# EAGLE design bmowdisk (EAGLE 6.6.0)
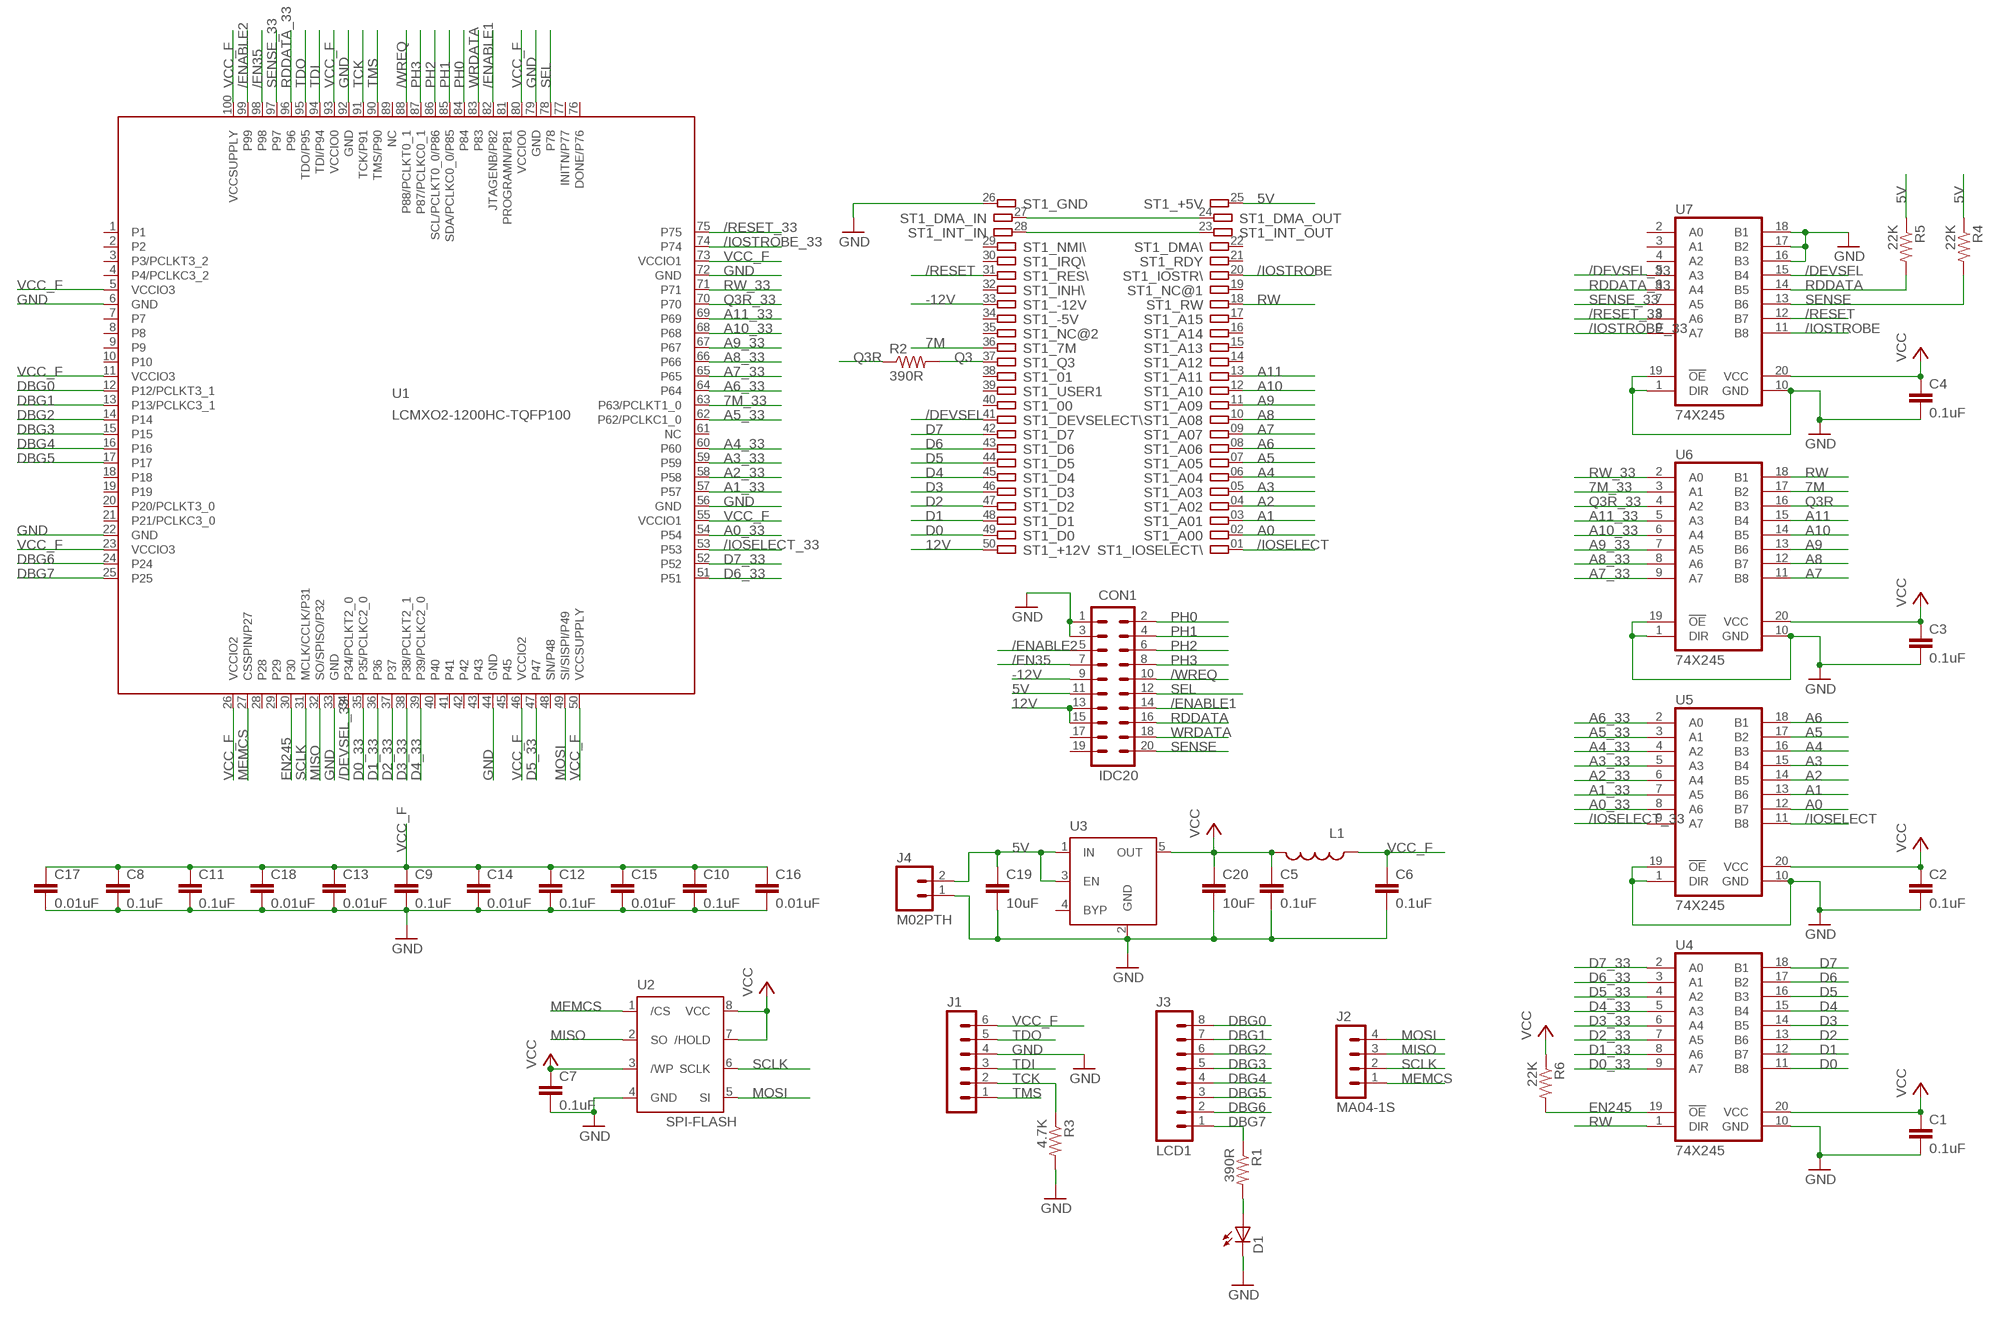
[diagram p0: schematic, sheet 1]

## Parts
C1  0.1uF  CAP0805  [0805]
C2  0.1uF  CAP0805  [0805]
C3  0.1uF  CAP0805  [0805]
C4  0.1uF  CAP0805  [0805]
C5  0.1uF  CAP0805  [0805]
C6  0.1uF  CAP0805  [0805]
C7  0.1uF  CAP0805  [0805]
C8  0.1uF  CAP0805  [0805]
C9  0.1uF  CAP0805  [0805]
C10  0.1uF  CAP0805  [0805]
C11  0.1uF  CAP0805  [0805]
C12  0.1uF  CAP0805  [0805]
C13  0.01uF  CAP0805  [0805]
C14  0.01uF  CAP0805  [0805]
C15  0.01uF  CAP0805  [0805]
C16  0.01uF  CAP0805  [0805]
C17  0.01uF  CAP0805  [0805]
C18  0.01uF  CAP0805  [0805]
C19  10uF  CAP0805  [0805]
C20  10uF  CAP0805  [0805]
CON1  IDC20  [IDC20]
D1  LEDCHIP-LED0805  [CHIP-LED0805]
J1  MA06-1NORMAL  [MA06-1]
J2  MA04-1S  [MA04-1]
J3  LCD1  M081X08  [1X08]
J4  M02PTH  [1X02]
L1  INDUCTOR0805  [0805]
R1  390R  RESISTOR0805-RES  [0805]
R2  390R  RESISTOR0805-RES  [0805]
R3  4.7K  RESISTOR0805-RES  [0805]
R4  22K  RESISTOR0805-RES  [0805]
R5  22K  RESISTOR0805-RES  [0805]
R6  22K  RESISTOR0805-RES  [0805]
ST1  A2-50PINMINI  [A2-50PIN-MINI]
U1  LCMXO2-1200HC-TQFP100  [TQFP100]
U2  SPI-FLASH  [SOIC08]
U3  MIC5219XX  [SOT23-5]
U4  74X245  [SSOP20]
U5  74X245  [SSOP20]
U6  74X245  [SSOP20]
U7  74X245  [SSOP20]

## Nets
5V: C19.1 CON1.11 J4.2 R4.1 R5.1 ST1.25 U3.1(IN) U3.3(EN)
7M: ST1.36 U6.17(B2)
7M_33: U1.63(P63/PCLKT1_0) U6.3(A1)
12V: CON1.13 CON1.15 ST1.50
-12V: CON1.9 ST1.33
/DEVSEL: ST1.41 U7.15(B4)
/DEVSEL_33: U1.34(P34/PCLKT2_0) U7.5(A3)
/EN35: CON1.7 U1.98
/ENABLE1: CON1.14 U1.82(JTAGENB/P82)
/ENABLE2: CON1.5 U1.99
/IOSELECT: ST1.01 U5.11(B8)
/IOSELECT_33: U1.53 U5.9(A7)
/IOSTROBE: ST1.20 U7.11(B8)
/IOSTROBE_33: U1.74 U7.9(A7)
/RESET: ST1.31 U7.12(B7)
/RESET_33: U1.75 U7.8(A6)
/WREQ: CON1.10 U1.88(P88/PCLKT0_1)
A0: ST1.02 U5.12(B7)
A0_33: U1.54 U5.8(A6)
A1: ST1.03 U5.13(B6)
A1_33: U1.57 U5.7(A5)
A2: ST1.04 U5.14(B5)
A2_33: U1.58 U5.6(A4)
A3: ST1.05 U5.15(B4)
A3_33: U1.59 U5.5(A3)
A4: ST1.06 U5.16(B3)
A4_33: U1.60 U5.4(A2)
A5: ST1.07 U5.17(B2)
A5_33: U1.62(P62/PCLKC1_0) U5.3(A1)
A6: ST1.08 U5.18(B1)
A6_33: U1.64 U5.2(A0)
A7: ST1.09 U6.11(B8)
A7_33: U1.65 U6.9(A7)
A8: ST1.10 U6.12(B7)
A8_33: U1.66 U6.8(A6)
A9: ST1.11 U6.13(B6)
A9_33: U1.67 U6.7(A5)
A10: ST1.12 U6.14(B5)
A10_33: U1.68 U6.6(A4)
A11: ST1.13 U6.15(B4)
A11_33: U1.69 U6.5(A3)
D0: ST1.49 U4.11(B8)
D0_33: U1.35(P35/PCLKC2_0) U4.9(A7)
D1: ST1.48 U4.12(B7)
D1_33: U1.36 U4.8(A6)
D2: ST1.47 U4.13(B6)
D2_33: U1.37 U4.7(A5)
D3: ST1.46 U4.14(B5)
D3_33: U1.38(P38/PCLKT2_1) U4.6(A4)
D4: ST1.45 U4.15(B4)
D4_33: U1.39(P39/PCLKC2_0) U4.5(A3)
D5: ST1.44 U4.16(B3)
D5_33: U1.47 U4.4(A2)
D6: ST1.43 U4.17(B2)
D6_33: U1.51 U4.3(A1)
D7: ST1.42 U4.18(B1)
D7_33: U1.52 U4.2(A0)
DBG0: J3.8 U1.12(P12/PCLKT3_1)
DBG1: J3.7 U1.13(P13/PCLKC3_1)
DBG2: J3.6 U1.14
DBG3: J3.5 U1.15
DBG4: J3.4 U1.16
DBG5: J3.3 U1.17
DBG6: J3.2 U1.24
DBG7: J3.1 R1.1 U1.25
EN245: R6.2 U1.30 U4.19(!OE)
GND: C1.2 C2.2 C3.2 C4.2 C5.2 C6.2 C7.2 C8.2 C9.2 C10.2 C11.2 C12.2 C13.2 C14.2 C15.2 C16.2 C17.2 C18.2 C19.2 C20.2 CON1.1 CON1.3 D1.C J1.4 J4.1 R3.2 ST1.26 U1.6(GND) U1.22(GND) U1.33(GND) U1.44(GND) U1.56(GND) U1.72(GND) U1.79(GND) U1.92(GND) U2.4(GND) U3.2(GND) U4.10(GND) U5.1(DIR) U5.10(GND) U5.19(!OE) U6.1(DIR) U6.10(GND) U6.19(!OE) U7.1(DIR) U7.10(GND) U7.16(B3) U7.17(B2) U7.18(B1) U7.19(!OE)
MEMCS: J2.1 U1.27(CSSPIN/P27) U2.1(/CS)
MISO: J2.3 U1.32(SO/SPISO/P32) U2.2(SO)
MOSI: J2.4 U1.49(SI/SISPI/P49) U2.5(SI)
N$1: ST1.24 ST1.27
N$2: ST1.23 ST1.28
N$5: D1.A R1.2
PH0: CON1.2 U1.84
PH1: CON1.4 U1.85(SDA/PCLKC0_0/P85)
PH2: CON1.6 U1.86(SCL/PCLKT0_0/P86)
PH3: CON1.8 U1.87(P87/PCLKC0_1)
Q3: R2.2 ST1.37
Q3R: R2.1 U6.16(B3)
Q3R_33: U1.70 U6.4(A2)
RDDATA: CON1.16 R5.2 U7.14(B5)
RDDATA_33: U1.96 U7.6(A4)
RW: ST1.18 U4.1(DIR) U6.18(B1)
RW_33: U1.71 U6.2(A0)
SCLK: J2.2 U1.31(MCLK/CCLK/P31) U2.6(SCLK)
SEL: CON1.12 U1.78
SENSE: CON1.20 R4.2 U7.13(B6)
SENSE_33: U1.97 U7.7(A5)
TCK: J1.2 R3.1 U1.91(TCK/P91)
TDI: J1.3 U1.94(TDI/P94)
TDO: J1.5 U1.95(TDO/P95)
TMS: J1.1 U1.90(TMS/P90)
VCC: C1.1 C2.1 C3.1 C4.1 C5.1 C7.1 C20.1 L1.2 R6.1 U2.3(/WP) U2.7(/HOLD) U2.8(VCC) U3.5(OUT) U4.20(VCC) U5.20(VCC) U6.20(VCC) U7.20(VCC)
VCC_F: C6.1 C8.1 C9.1 C10.1 C11.1 C12.1 C13.1 C14.1 C15.1 C16.1 C17.1 C18.1 J1.6 L1.1 U1.5(VCCIO3) U1.11(VCCIO3) U1.23(VCCIO3) U1.26(VCCIO2) U1.46(VCCIO2) U1.50(VCCSUPPLY) U1.55(VCCIO1) U1.73(VCCIO1) U1.80(VCCIO0) U1.93(VCCIO0) U1.100(VCCSUPPLY)
WRDATA: CON1.18 U1.83
Unconnected: CON1.17 CON1.19 ST1.14 ST1.15 ST1.16 ST1.17 ST1.19 ST1.21 ST1.22 ST1.29 ST1.30 ST1.32 ST1.34 ST1.35 ST1.38 ST1.39 ST1.40 U1.1 U1.2 U1.3(P3/PCLKT3_2) U1.4(P4/PCLKC3_2) U1.7 U1.8 U1.9 U1.10 U1.18 U1.19 U1.20(P20/PCLKT3_0) U1.21(P21/PCLKC3_0) U1.28 U1.29 U1.40 U1.41 U1.42 U1.43 U1.45 U1.48(SN/P48) U1.61(NC) U1.76(DONE/P76) U1.77(INITN/P77) U1.81(PROGRAMN/P81) U1.89(NC) U3.4(BYP) U7.2(A0) U7.3(A1) U7.4(A2)

## Library data of the parts
C1-C20 = SparkFun:CAP: Capacitor Standard 0603 ceramic capacitor, and 0.1" leaded capacitor.
CON1 = big-mess-o-wires:IDC20
D1 = led:LED: LED OSRAM: - CHIPLED LG R971, LG N971, LY N971, LG Q971, LY Q971, LO R971, LY R971 LH N974, LH R974 LS Q976, LO Q976, LY Q976 LO Q996 - Hyper CHIPLED LW Q18S LB Q993, LB Q99A, LB R99A - SideLED LS A670, LO A670, LY A670, LG A670, LP A670 LB A673, LV A673, LT A673, LW A673 LH A674 LY A675 LS A676, LA A676, LO A676, LY A676, LW A676 LS A679, LY A679, LG A679 - Hyper Micro SIDELED® LS Y876, LA Y876, LO Y876, LY Y876 LT Y87S - SmartLED LW L88C, LW L88S LB L89C, LB L89S, LG L890 LS L89K, LO L89K, LY L89K LS L896, LA L896, LO L896, LY L896 - TOPLED LS T670, LO T670, LY T670, LG T670, LP T670 LSG T670, LSP T670, LSY T670, LOP T670, LYG T670 LG T671, LOG T671, LSG T671 LB T673, LV T673, LT T673, LW T673 LH T674 LS T676, LA T676, LO T676, LY T676, LB T676, LH T676, LSB T676, LW T676 LB T67C, LV T67C, LT T67C, LS T67K, LO T67K, LY T67K, LW E67C LS E67B, LA E67B, LO E67B, LY E67B, LB E67C, LV E67C, LT E67C LW T67C LS T679, LY T679, LG T679 LS T770, LO T770, LY T770, LG T770, LP T770 LB T773, LV T773, LT T773, LW T773 LH T774 LS E675, LA E675, LY E675, LS T675 LS T776, LA T776, LO T776, LY T776, LB T776 LHGB T686 LT T68C, LB T68C - Hyper Mini TOPLED® LB M676 - Mini TOPLED Santana® LG M470 LS M47K, LO M47K, LY M47K Source: http://www.osram.convergy.de LUXEON: - LUMILED® LXK2-PW12-R00, LXK2-PW12-S00, LXK2-PW14-U00, LXK2-PW14-V00 LXK2-PM12-R00, LXK2-PM12-S00, LXK2-PM14-U00 LXK2-PE12-Q00, LXK2-PE12-R00, LXK2-PE12-S00, LXK2-PE14-T00, LXK2-PE14-U00 LXK2-PB12-K00, LXK2-PB12-L00, LXK2-PB12-M00, LXK2-PB14-N00, LXK2-PB14-P00, LXK2-PB14-Q00 LXK2-PR12-L00, LXK2-PR12-M00, LXK2-PR14-Q00, LXK2-PR14-R00 LXK2-PD12-Q00, LXK2-PD12-R00, LXK2-PD12-S00 LXK2-PH12-R00, LXK2-PH12-S00 LXK2-PL12-P00, LXK2-PL12-Q00, LXK2-PL12-R00 Source: www.luxeon.com KINGBRIGHT: KA-3528ASYC Source: www.kingbright.com
J1 = retro-usb-2:MA06-1: PIN HEADER; OC_FARNELL: unknown; OC_NEWARK: unknown
J2 = retro-usb-2:MA04-1
J3 = SparkFun:M08: Header 8 Standard 8-pin 0.1" header. Use with straight break away headers (SKU : PRT-00116), right angle break away headers (PRT-00553), swiss pins (PRT-00743), machine pins (PRT-00117), and female headers (PRT-00115).
J4 = SparkFun-Connectors:M02: Standard 2-pin 0.1" header. Use with - straight break away headers ( PRT-00116) - right angle break away headers (PRT-00553) - swiss pins (PRT-00743) - machine pins (PRT-00117) - female headers (PRT-00115) Molex polarized connector foot print use with: PRT-08233 with associated crimp pins and housings. 2.54_SCREWTERM for use with PRT-10571. 3.5mm Screw Terminal footprints for PRT-08084 5mm Screw Terminal footprints for use with PRT-08433
L1 = SparkFun-Passives:INDUCTOR: Inductors Basic Inductor/Choke - 0603 and 1206. Footprints are not proven and vary greatly between part numbers. SRN6045- 33uH, 20% 1.4A SDR0403-560KL - 56uH, 10%, 500mA RMS/740mA peak
R1-R6 = SparkFun:RESISTOR: Resistor Basic schematic elements and footprints for 0603, 1206, and PTH resistors.
ST1 = con-apple2:A2-50PIN: Apple ][ Peripheral Card Connector This is the, default, 50-pin connector for slot #1 to #7 Pins are laid out as seen from the top of the slot
U1 = bmowdisk:LCMXO2-1200HC-TQFP100
U2 = bmowdisk:SPI-FLASH
U3 = v-reg-micrel:MIC5219XX: VOLTAGE REGULATOR; OC_FARNELL: unknown; OC_NEWARK: unknown
U4-U7 = bmowdisk:74X245

## Net classes
1 thick: width 0.381 mm

## Board
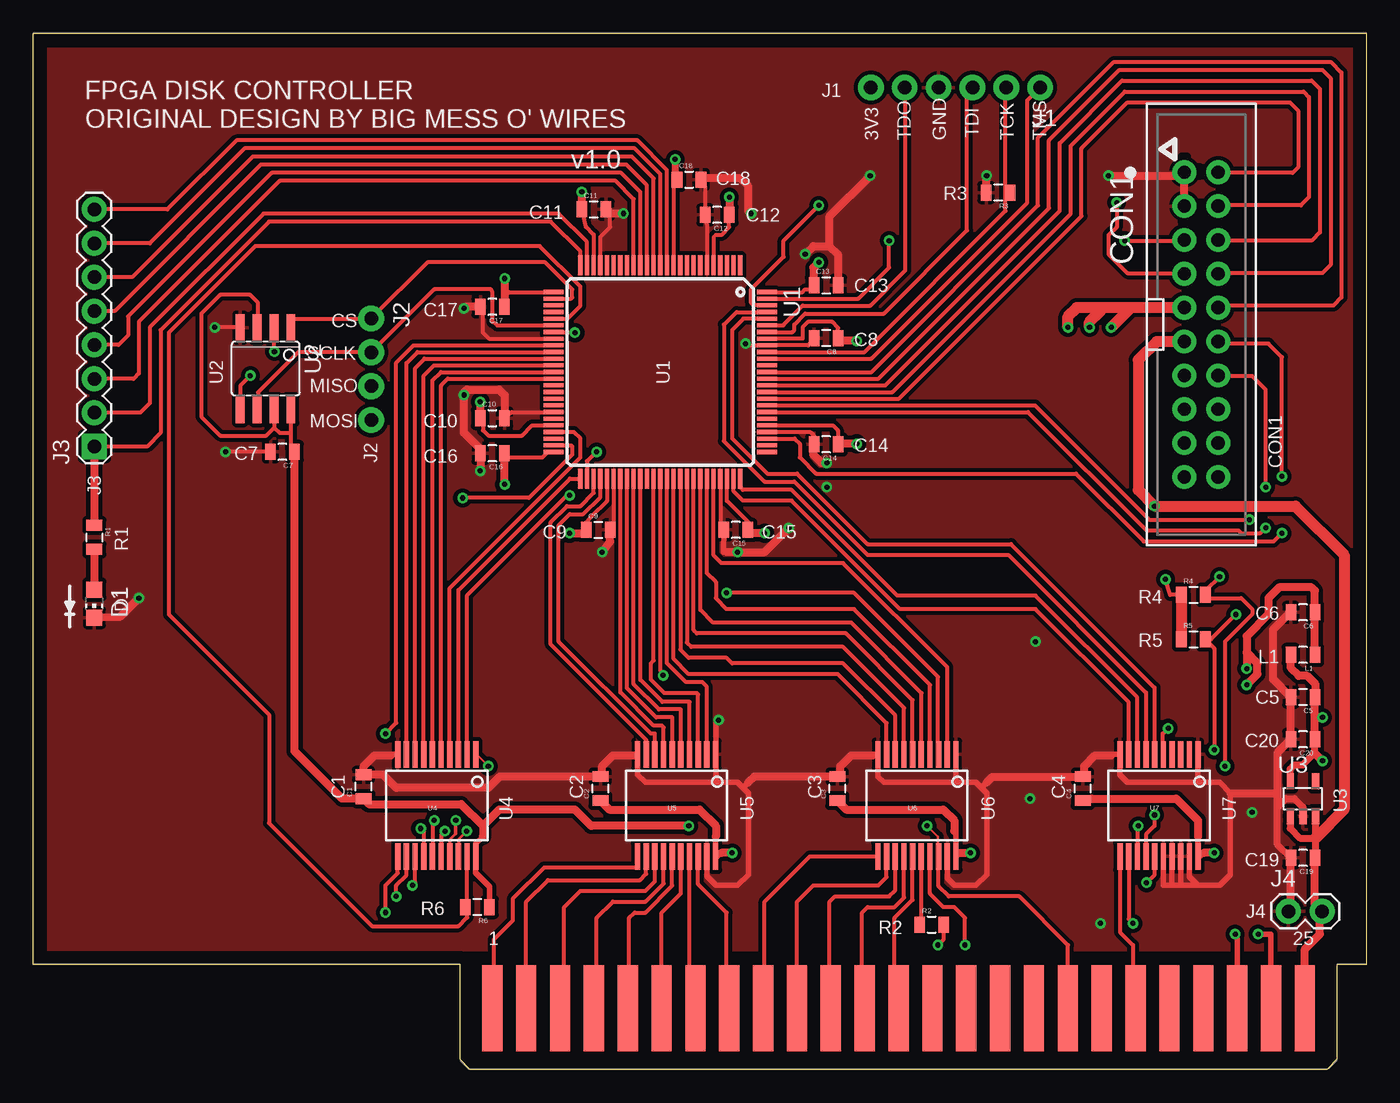
[diagram p1: board, top side]
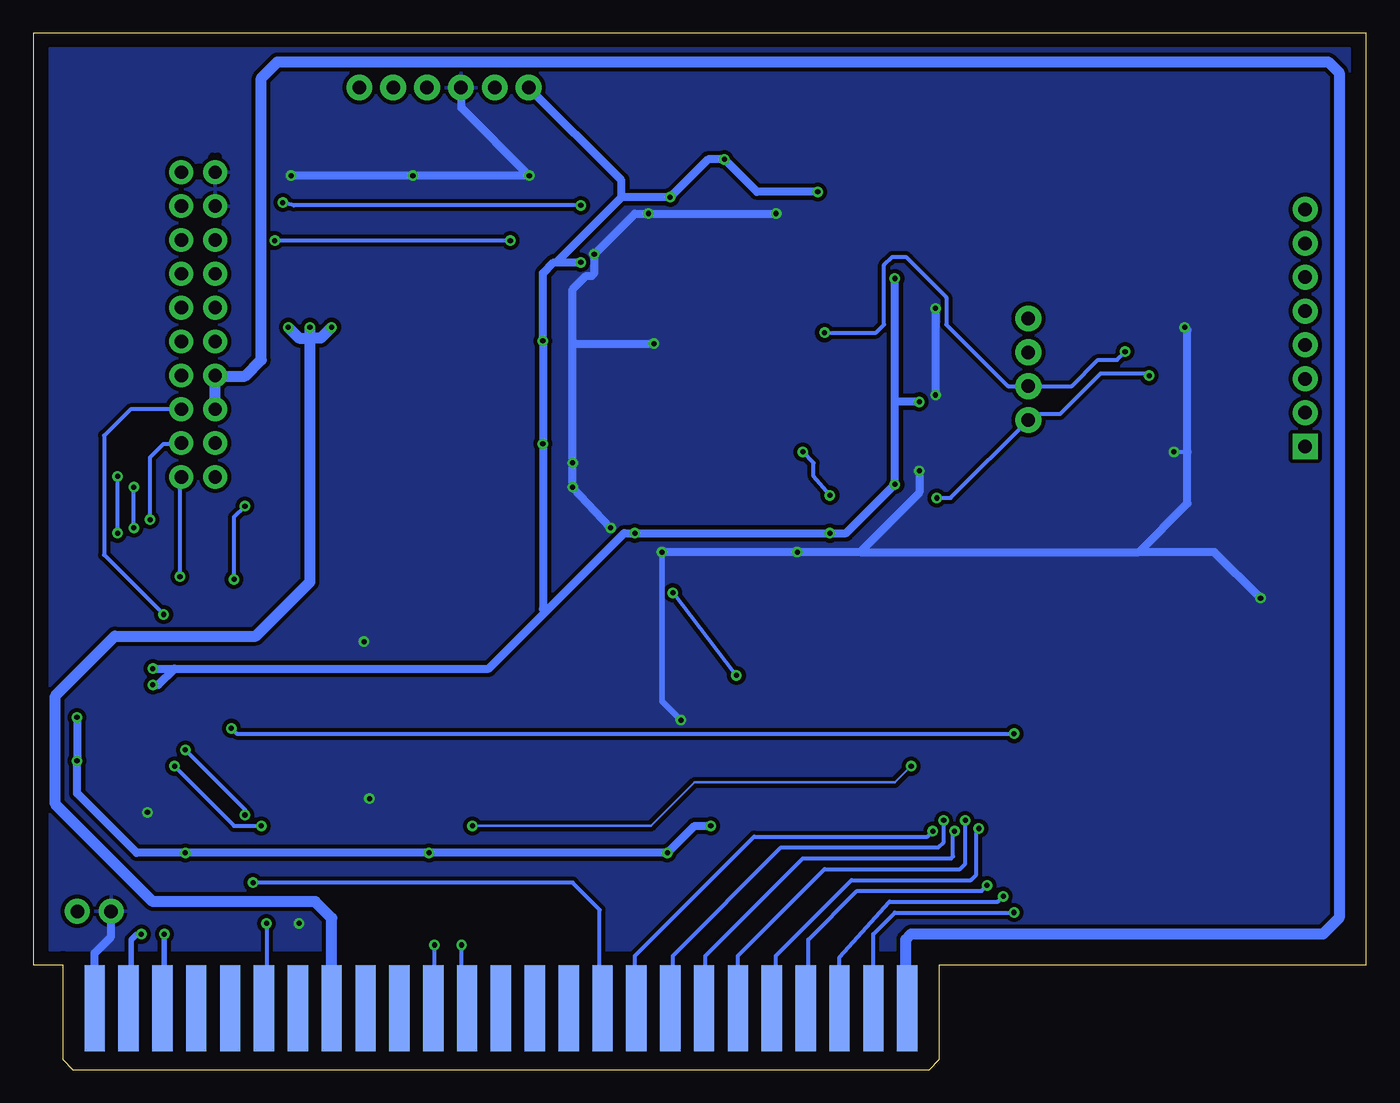
[diagram p2: board, bottom side, seen from below]

Size 100 x 77.72 mm. Coordinates in mm from the lower left corner, seen from the top.
Outline: 0,7.87 0,77.72 100,77.72 100,7.87 97.79,7.87 97.79,0.76 97.03,0 32.77,0 32,0.76 32,7.87 0,7.87
Copper layers (1*16): Top 0.035mm / dielectric 1.5mm / Bottom 0.035mm
Design rules "default *": minimum track width 8mil, minimum drill 15mil, track to track 0.187959375mm, track to pad 0.187959375mm, pad to pad 0.187959375mm, via to via 8mil, smd to smd 0.187959375mm, copper to edge 40mil, drill to drill 8mil, minimum pad ring 10mil, minimum via ring 8mil, stop-mask expansion 4mil, vias tented up to drill 15mil, thermal gap 10mil
tRestrict: area 87.4,67.1 to 87.6,67.7; area 86.2,68.3 to 86.6,68.5; area 87.4,64.4 to 87.6,65; area 86.2,63.6 to 86.6,63.8
bRestrict: area 86.2,68.3 to 86.6,68.5; area 87.4,67.1 to 87.6,67.7; area 87.4,64.4 to 87.6,65; area 86.2,63.6 to 86.6,63.8

### Footprints (pad centres in the part's own frame; a part is rotated, then mirrored left to right if it is on the bottom)
0805 = smd 0.8 x 1.2: 1 -0.9,0; 2 0.9,0
IDC20 = drill 1 pad 1.778: 1 -11.43,-1.27; 2 -11.43,1.27; 3 -8.89,-1.27; 4 -8.89,1.27; 5 -6.35,-1.27; 6 -6.35,1.27; 7 -3.81,-1.27; 8 -3.81,1.27; 9 -1.27,-1.27; 10 -1.27,1.27; 11 1.27,-1.27; 12 1.27,1.27; 13 3.81,-1.27; 14 3.81,1.27; 15 6.35,-1.27; 16 6.35,1.27; 17 8.89,-1.27; 18 8.89,1.27; 19 11.43,-1.27; 20 11.43,1.27
CHIP-LED0805 = smd 1.2 x 1.2: A 0,-1.05; C 0,1.05
MA06-1 = drill 1.016 pad 1.93: 1 -6.35,0; 2 -3.81,0; 3 -1.27,0; 4 1.27,0; 5 3.81,0; 6 6.35,0
MA04-1 = drill 1.016 pad 1.93: 1 -3.81,0; 2 -1.27,0; 3 1.27,0; 4 3.81,0
1X08 = drill 1.016 pad 1.88 square: 1 0,0 | drill 1.016 pad 1.88: 2 2.54,0; 3 5.08,0; 4 7.62,0; 5 10.16,0; 6 12.7,0; 7 15.24,0; 8 17.78,0
1X02 = drill 1.016 pad 1.88: 1 0,0; 2 2.54,0
A2-50PIN-MINI = smd 1.524 x 6.477: 01 27.435,-29.845; 02 29.975,-29.845; 03 32.515,-29.845; 04 35.055,-29.845; 05 37.595,-29.845; 06 40.135,-29.845; 07 42.675,-29.845; 08 45.215,-29.845; 09 47.755,-29.845; 10 50.295,-29.845; 11 52.835,-29.845; 12 55.375,-29.845; 13 57.915,-29.845; 14 60.455,-29.845; 15 62.995,-29.845; 16 65.535,-29.845; 17 68.075,-29.845; 18 70.615,-29.845; 19 73.155,-29.845; 20 75.695,-29.845; 21 78.235,-29.845; 22 80.775,-29.845; 23 83.315,-29.845; 24 85.855,-29.845; 25 88.395,-29.845 | smd 1.524 x 6.477 bottom: 26 88.395,-29.845; 27 85.855,-29.845; 28 83.315,-29.845; 29 80.775,-29.845; 30 78.235,-29.845; 31 75.695,-29.845; 32 73.155,-29.845; 33 70.615,-29.845; 34 68.075,-29.845; 35 65.535,-29.845; 36 62.995,-29.845; 37 60.455,-29.845; 38 57.915,-29.845; 39 55.375,-29.845; 40 52.835,-29.845; 41 50.295,-29.845; 42 47.755,-29.845; 43 45.215,-29.845; 44 42.675,-29.845; 45 40.135,-29.845; 46 37.595,-29.845; 47 35.055,-29.845; 48 32.515,-29.845; 49 29.975,-29.845; 50 27.435,-29.845
TQFP100 = smd 1.5 x 0.31: 1 -8,6; 2 -8,5.5; 3 -8,5; 4 -8,4.5; 5 -8,4; 6 -8,3.5; 7 -8,3; 8 -8,2.5; 9 -8,2; 10 -8,1.5; 11 -8,1; 12 -8,0.5; 13 -8,0; 14 -8,-0.5; 15 -8,-1; 16 -8,-1.5; 17 -8,-2; 18 -8,-2.5; 19 -8,-3; 20 -8,-3.5; 21 -8,-4; 22 -8,-4.5; 23 -8,-5; 24 -8,-5.5; 25 -8,-6; 51 8,-6; 52 8,-5.5; 53 8,-5; 54 8,-4.5; 55 8,-4; 56 8,-3.5; 57 8,-3; 58 8,-2.5; 59 8,-2; 60 8,-1.5; 61 8,-1; 62 8,-0.5; 63 8,0; 64 8,0.5; 65 8,1; 66 8,1.5; 67 8,2; 68 8,2.5; 69 8,3; 70 8,3.5; 71 8,4; 72 8,4.5; 73 8,5; 74 8,5.5; 75 8,6 | smd 0.31 x 1.5: 26 -6,-8; 27 -5.5,-8; 28 -5,-8; 29 -4.5,-8; 30 -4,-8; 31 -3.5,-8; 32 -3,-8; 33 -2.5,-8; 34 -2,-8; 35 -1.5,-8; 36 -1,-8; 37 -0.5,-8; 38 0,-8; 39 0.5,-8; 40 1,-8; 41 1.5,-8; 42 2,-8; 43 2.5,-8; 44 3,-8; 45 3.5,-8; 46 4,-8; 47 4.5,-8; 48 5,-8; 49 5.5,-8; 50 6,-8; 76 6,8; 77 5.5,8; 78 5,8; 79 4.5,8; 80 4,8; 81 3.5,8; 82 3,8; 83 2.5,8; 84 2,8; 85 1.5,8; 86 1,8; 87 0.5,8; 88 0,8; 89 -0.5,8; 90 -1,8; 91 -1.5,8; 92 -2,8; 93 -2.5,8; 94 -3,8; 95 -3.5,8; 96 -4,8; 97 -4.5,8; 98 -5,8; 99 -5.5,8; 100 -6,8
SOIC08 = smd 0.66 x 2.032: 1 -1.905,-3.073; 2 -0.635,-3.073; 3 0.635,-3.073; 4 1.905,-3.073; 5 1.905,3.073; 6 0.635,3.073; 7 -0.635,3.073; 8 -1.905,3.073
SOT23-5 = smd 0.55 x 1.2: 1 -0.95,-1.3; 2 0,-1.3; 3 0.95,-1.3; 4 0.95,1.3; 5 -0.95,1.3
SSOP20 = smd 0.4 x 2: 1 -2.925,-3.825; 2 -2.275,-3.825; 3 -1.625,-3.825; 4 -0.975,-3.825; 5 -0.325,-3.825; 6 0.325,-3.825; 7 0.975,-3.825; 8 1.625,-3.825; 9 2.275,-3.825; 10 2.925,-3.825; 11 2.925,3.825; 12 2.275,3.825; 13 1.625,3.825; 14 0.975,3.825; 15 0.325,3.825; 16 -0.325,3.825; 17 -0.975,3.825; 18 -1.625,3.825; 19 -2.275,3.825; 20 -2.925,3.825

### Placement (x,y rotation side)
C1  24.77,21.22 90 top
C2  42.55,21.08 90 top
C3  60.33,21.08 90 top
C4  78.74,21.08 90 top
C5  95.25,27.94 180 top
C6  95.25,34.29 180 top
C7  18.69,46.33 180 top
C8  59.49,54.86 180 top
C9  42.39,40.49 0 top
C10  34.44,48.87 0 top
C11  42.06,64.52 0 top
C12  51.31,64.11 180 top
C13  59.49,58.83 0 top
C14  59.49,46.89 180 top
C15  52.7,40.49 180 top
C16  34.44,46.23 180 top
C17  34.44,57.2 180 top
C18  49.2,66.75 0 top
C19  95.25,15.88 180 top
C20  95.25,24.77 180 top
CON1  87.63,55.88 270 top
D1  4.57,34.95 180 top
J1  69.19,73.66 180 top
J2  25.35,52.53 270 top
J3  4.57,46.74 90 top
J4  94.16,11.87 0 top
L1  95.25,31.11 180 top
R1  4.57,39.93 270 top
R2  67.41,10.87 0 top
R3  72.39,65.79 180 top
R4  87.03,35.61 0 top
R5  87.03,32.26 0 top
R6  33.32,12.19 180 top
ST1  7,34.45 0 top
U1  47.04,52.32 270 top
U2  17.42,52.58 180 top
U3  95.25,20.32 0 top
U4  30.27,19.81 180 top
U5  48.26,19.81 180 top
U6  66.29,19.81 180 top
U7  84.45,19.81 180 top

### Tracks (layer width: path | path; a pad name or v marks a point on that pad's centre or on a via)
5V  (via drill 0.38)
  Top 0.305: R4.1 85.29,35.61 v84.94,36.78
  Top 0.533: C19.1 96.2,15.93 96.2,17.37 | 96.2,17.37 U3.3 | U3.1 94.3,18.09 95.02,17.37 96.2,17.37
  Top 0.61: ST1.25 95.39,9.04 96.52,10.16 96.52,11.69 J4.2 96.15,12.42 C19.1
  Top 0.813: CON1.11 84.28,54.61 82.91,53.24 82.91,43.48 v84.12,42.27 94.69,42.27 98.35,38.61 98.35,19.52 96.2,17.37 | R4.1 R5.1
  Bottom 0.305: v84.94,36.78 84.94,41.45 v84.12,42.27
7M  (via drill 0.38)
  Top 0.305: v69.9,9.35 69.9,11.38 69.09,12.19 68.28,12.19 67.27,13.2 U6.17
  Bottom 0.203: ST1.36 69.9,4.7
  Bottom 0.305: 69.9,4.7 v69.9,9.35
7M_33  (via drill 0.38)
  Top 0.305: U6.3 67.87,23.69 67.87,29.46 61.57,35.76 v52.02,35.76 | v47.24,29.57 47.14,29.67 47.04,29.97 U1.63
  Bottom 0.305: v52.02,35.76 47.35,29.67 v47.24,29.57
12V
  Bottom 0.813: ST1.50 34.54,4.71 34.54,9.75 34.14,10.16 3.25,10.16 2.03,11.38 2.03,74.78 2.85,75.59 81.69,75.59 82.91,74.37 82.91,53.24 84.12,52.02 86.56,52.02 86.36,51.82 CON1.15 CON1.13
-12V  (via drill 0.38)
  Top 0.813: v80.87,55.68 82.35,57.15 | v79.25,55.68 79.25,56.08 80.06,56.9 | v77.62,55.68 77.62,56.49 78.28,57.15 CON1.9
  Bottom 0.813: ST1.33 77.61,11.37 78.84,12.6 91.03,12.6 98.35,19.91 98.35,28.04 93.88,32.51 83.31,32.51 79.25,36.58 79.25,54.86 | 79.25,54.86 v79.25,55.68 | v80.87,55.68 80.06,54.86 79.25,54.86 | v77.62,55.68 78.44,54.86 79.25,54.86
/DEVSEL  (via drill 0.38)
  Top 0.305: v83.52,14.02 84.13,14.64 U7.15
  Bottom 0.305: ST1.41 57.51,4.82 57.51,11.99 59.54,14.02 v83.52,14.02
/DEVSEL_33  (via drill 0.38)
  Top 0.305: U7.5 84.73,23.68 84.73,25.2 v85.14,25.6 | v26.42,25.2 27.23,26.01 27.23,53.03 28.52,54.32 U1.34
  Bottom 0.305: v85.14,25.6 84.73,25.2 v26.42,25.2
/EN35  (via drill 0.38)
  Top 0.305: U1.98 54.03,57.32 53.85,57.51 53.85,58.52 56.29,60.96 56.29,62.18 v58.93,64.82 | v81.28,65.02 81.28,63.2 80.67,62.59 80.67,61.16 82.09,59.74 86.31,59.74 CON1.7
  Bottom 0.305: v58.93,64.82 80.47,64.82 v81.28,65.02
/ENABLE1  (via drill 0.38)
  Top 0.305: U1.82 74.63,49.32 83.52,40.44 90.42,40.44 90.63,40.23 92.05,40.23 v92.46,40.64 | v92.46,43.69 92.46,51 91.44,52.02 88.95,52.02 CON1.14
  Bottom 0.305: v92.46,40.64 v92.46,43.69
/ENABLE2  (via drill 0.38)
  Top 0.305: U1.99 61.89,57.82 64.21,60.15 v64.21,62.18 | v81.89,62.18 86.31,62.18 CON1.5
  Bottom 0.305: v64.21,62.18 v81.89,62.18
/IOSELECT
  Top 0.203: 45.11,15.17 45.34,15.4 U5.11
  Top 0.305: 45.11,15.17 38.34,15.17 35.97,12.8 35.97,11.18 34.54,9.75 34.54,4.71 ST1.01
/IOSELECT_33
  Top 0.305: U5.9 45.98,24.73 38.81,31.9 38.81,41.05 40.03,42.27 41.05,42.27 42.04,43.26 U1.53
/IOSTROBE
  Top 0.203: 82.5,4.8 ST1.20
  Top 0.305: U7.11 81.53,10.32 82.5,9.35 82.5,4.8
/IOSTROBE_33
  Top 0.305: U7.9 82.18,27.55 75.18,34.54 65.02,34.54 56.9,42.67 53.24,42.67 52.54,43.37 U1.74
/RESET  (via drill 0.38)
  Top 0.305: U7.12 82.18,11.29 v82.5,10.97
  Bottom 0.203: 82.5,4.8 ST1.31
  Bottom 0.305: v82.5,10.97 82.5,4.8
/RESET_33
  Top 0.305: U7.8 82.83,27.91 75.18,35.56 64.82,35.56 56.9,43.48 53.24,43.48 53.03,43.69 U1.75
/WREQ
  Top 0.305: U1.88 62.89,52.32 75.39,64.82 75.39,69.9 81.08,75.59 97.33,75.59 98.15,74.78 98.15,57.91 97.54,57.3 89.05,57.3 CON1.10
A0
  Top 0.203: ST1.02
  Top 0.305: ST1.02 36.98,12.6 38.61,14.22 45.52,14.22 45.98,14.69 U5.12
A0_33
  Top 0.305: U5.8 46.63,25.2 46.33,25.2 39.42,32.11 39.42,40.84 40.23,41.66 41.25,41.66 42.54,42.95 U1.54
A1
  Top 0.203: ST1.03 39.83,4.92
  Top 0.305: 39.83,4.92 39.83,12.19 41.05,13.41 45.92,13.41 46.63,14.12 U5.13
A1_33
  Top 0.305: U5.7 47.28,25.66 47.14,25.81 46.53,25.81 44.04,28.3 U1.57
A2
  Top 0.203: ST1.04 42.27,4.82
  Top 0.305: 42.27,4.82 42.27,11.38 43.48,12.6 45.92,12.6 47.28,13.96 U5.14
A2_33
  Top 0.305: U5.6 47.95,23.66 47.95,26.42 46.74,26.42 44.54,28.61 U1.58
A3
  Top 0.203: ST1.05 44.7,4.71
  Top 0.305: 44.7,4.71 44.7,11.38 45.11,11.79 45.92,11.79 47.94,13.8 U5.15
A3_33
  Top 0.305: U5.5 48.59,27 48.56,27.03 46.94,27.03 45.04,28.92 U1.59
A4
  Top 0.203: ST1.06 47.14,4.61
  Top 0.305: 47.14,4.61 47.14,11.79 48.59,13.23 U5.16
A4_33
  Top 0.305: U5.4 49.23,27.57 47.2,27.57 45.54,29.24 U1.60
A5
  Top 0.203: ST1.07 49.23,5.04
  Top 0.305: 49.23,5.04 U5.17
A5_33
  Top 0.305: U5.3 49.88,28.14 49.78,28.25 47.35,28.25 46.33,29.26 46.33,30.48 46.54,30.69 U1.62
A6
  Top 0.203: ST1.08 52.02,4.8
  Top 0.305: 52.02,4.8 52.02,11.79 49.88,13.92 U5.18
A6_33
  Top 0.305: U5.2 50.53,28.71 50.19,29.06 48.97,29.06 47.54,30.49 U1.64
A7
  Top 0.203: ST1.09 54.86,4.71
  Top 0.305: 54.86,4.71 54.86,12.6 58.25,15.99 U6.11
A7_33
  Top 0.305: U6.9 64.02,26 60.35,29.67 49.17,29.67 48.04,30.8 U1.65
A8
  Top 0.203: ST1.10
  Top 0.305: ST1.10 57.3,12.6 58.52,13.82 63.4,13.82 64.02,14.44 U6.12
A8_33
  Top 0.305: U6.8 64.67,26.57 60.76,30.48 52.43,30.48 52.02,30.89 49.17,30.89 48.56,31.5 48.54,31.5 U1.66
A9
  Top 0.203: ST1.11 59.74,4.7
  Top 0.305: 59.74,4.7 59.74,12.6 60.15,13.01 64.21,13.01 64.67,13.46 U6.13
A9_33
  Top 0.305: U6.7 65.32,27.14 60.76,31.7 49.38,31.7 49.04,32.04 U1.67
A10
  Top 0.203: ST1.12 62.18,4.8
  Top 0.305: 62.18,4.8 62.18,11.79 62.59,12.19 64.62,12.19 65.32,12.89 U6.14
A10_33
  Top 0.305: U6.6 65.97,27.71 60.96,32.72 49.78,32.72 49.54,32.96 U1.68
A11
  Top 0.203: ST1.13 64.62,4.9
  Top 0.305: 64.62,4.9 64.62,11.38 65.97,12.73 U6.15
A11_33
  Top 0.305: U6.5 66.65,23.67 66.65,28.25 61.37,33.53 51,33.53 50.04,34.49 U1.69
D0  (via drill 0.38)
  Top 0.305: U4.11 27.34,14.75 26.42,13.82 v26.42,11.79
  Bottom 0.203: ST1.49
  Bottom 0.305: ST1.49 36.98,10.16 35.36,11.79 v26.42,11.79
D0_33
  Top 0.305: U4.9 28,52.99 28.83,53.82 U1.35
D1  (via drill 0.38)
  Top 0.305: v27.23,13.01 27.23,13.82 28,14.58 U4.12
  Bottom 0.305: ST1.48 39.52,8.44 35.76,12.6 27.64,12.6 v27.23,13.01
D1_33
  Top 0.305: U4.8 28.64,52.62 29.35,53.32 U1.36
D2  (via drill 0.38)
  Top 0.305: v28.45,13.82 28.64,14.02 U4.13
  Bottom 0.203: ST1.47 41.86,4.8
  Bottom 0.305: 41.86,4.8 41.86,9.75 38.2,13.41 28.85,13.41 v28.45,13.82
D2_33
  Top 0.305: U4.7 29.3,52.05 30.07,52.82 U1.37
D3  (via drill 0.38)
  Top 0.305: v29.06,18.09 29.3,17.85 U4.14
  Bottom 0.203: ST1.46 44.3,4.9
  Bottom 0.305: 44.3,4.9 44.3,8.53 38.61,14.22 29.67,14.22 29.26,14.63 29.26,17.88 v29.06,18.09
D3_33
  Top 0.305: U4.6 29.95,51.69 30.58,52.32 U1.38
D4  (via drill 0.38)
  Top 0.305: v30.07,18.69 29.95,18.57 U4.15
  Bottom 0.203: ST1.45 47.14,4.61
  Bottom 0.305: 47.14,4.61 47.14,8.53 40.64,15.04 30.48,15.04 30.07,15.44 v30.07,18.69
D4_33
  Top 0.305: U4.5 30.59,51.32 31.1,51.82 U1.39
D5  (via drill 0.38)
  Top 0.305: v30.89,17.88 30.59,17.59 U4.16
  Bottom 0.203: ST1.44 49.58,4.61 | 31,17.77 v30.89,17.88
  Bottom 0.305: 49.58,4.61 49.58,8.53 42.27,15.85 31.14,15.85 31,15.99 31,17.77
D5_33
  Top 0.305: U4.4 31.25,36.12 41.05,45.92 41.05,47.35 40.57,47.82 U1.47
D6  (via drill 0.38)
  Top 0.229: 31.7,17.68 31.25,17.22 U4.17
  Top 0.254: v31.7,18.69 31.7,17.68
  Bottom 0.203: ST1.43 52.02,4.8
  Bottom 0.305: 52.02,4.8 52.02,8.53 43.89,16.66 32.11,16.66 31.7,17.07 v31.7,18.69
D6_33
  Top 0.305: U4.3 31.9,23.64 31.9,35.97 40.26,44.32 U1.51
D7  (via drill 0.38)
  Top 0.229: v32.51,17.88 31.89,17.27 U4.18
  Bottom 0.203: ST1.42 54.86,4.71
  Bottom 0.305: 54.86,4.71 54.86,8.53 45.92,17.48 32.92,17.48 v32.51,17.88
D7_33  (via drill 0.38)
  Top 0.305: U4.2 32.55,35.59 40.03,43.08 v40.23,43.08 | v42.27,46.33 41.54,45.63 U1.52
  Bottom 0.305: v40.23,43.08 41.45,44.5 41.45,45.52 v42.27,46.33
DBG0
  Top 0.305: U1.12 47.54,67.47 45.31,69.7 15.24,69.7 10.06,64.52 J3.8 4.67,64.62
DBG1
  Top 0.305: U1.13 47.04,67.16 45.11,69.09 15.85,69.09 8.74,61.98 J3.7
DBG2
  Top 0.305: U1.14 46.54,66.84 44.91,68.48 16.46,68.48 7.42,59.44 J3.6
DBG3
  Top 0.305: U1.15 46.04,66.33 44.5,67.87 17.07,67.87 6.1,56.9 J3.5
DBG4
  Top 0.305: U1.16 45.54,65.81 44.09,67.26 17.88,67.26 7.11,56.49 7.11,55.07 6.4,54.36 J3.4 4.67,54.46
DBG5
  Top 0.305: U1.17 45.04,65.3 43.69,66.65 18.49,66.65 7.92,56.08 7.92,52.22 7.52,51.82 J3.3
DBG6
  Top 0.305: U1.24 41.54,62.09 39.42,64.21 17.27,64.21 8.74,55.68 8.74,49.99 8.03,49.28 J3.2 4.67,49.38
DBG7
  Top 0.305: U1.25 41.05,61.37 38.81,63.6 17.68,63.6 9.55,55.47 9.55,47.75 8.53,46.74 J3.1
  Top 0.61: J3.1 R1.1
EN245
  Top 0.305: U1.30 40.07,56.32 41.05,57.3 41.05,58.73 38,61.77 16.66,61.77 10.16,55.27 10.16,34.14 17.68,26.62 17.68,18.49 25.4,10.77 31.9,10.77 32.51,11.38 | 32.51,11.38 32.55,11.41 U4.19 | R6.2 32.51,12.11 32.51,11.38
GND  (via drill 0.38)
  Top 0.305: U1.22 42.54,62.45 43.28,63.2 43.28,64.21 43.28,64.5 C11.2 | U1.6 50.54,63.41 C12.2 50.41,66.21 C18.2 | U1.33 34.18,54.82 33.73,55.27 33.73,57.01 C17.2 | C10.2 35.9,49.32 U1.44 | U1.56 43.54,40.51 C9.2 | U1.72 51.54,40.73 C15.2 | U1.79 58.26,47.82 arc-90 C14.2 58.52,46.82 58.52,46.74 | C8.2 58.15,54.32 U1.92 53.58,54.32 v53.44,54.46 | U2.4 15.49,55.68 v13.61,55.68 | C7.2 v14.43,46.33
  Top 0.406: 45.11,23.57 45.18,23.64 U5.10 45.34,22.13 45.92,21.54 51.21,21.54 | 62.99,23.57 63.06,23.64 U6.10 63.37,21.98 63.8,21.54 69.22,21.54 | 26.82,23.57 26.89,23.64 U4.10 | 80.87,23.57 80.94,23.64 U7.10 81.53,22.1 82.09,21.54 87.38,21.54 | U5.19 50.53,14.49 51.21,13.82 52.83,13.82 53.65,14.63 53.65,20.73 53.24,21.13 | 53.24,21.13 52.83,21.54 51.21,21.54 | 51.21,21.54 51.21,23.62 U5.1 51.21,23.66 51.21,26.01 v51.41,26.21 | U6.19 68.57,14.34 69.09,13.82 70.71,13.82 71.53,14.63 71.53,20.73 71.12,21.13 | 71.12,21.13 70.71,21.54 69.22,21.54 | U6.1 69.22,21.54 | U7.19 86.73,14.46 87.38,13.82 | 87.38,13.82 89,13.82 89.81,14.63 89.81,20.73 89,21.54 87.38,21.54 | U7.1 87.38,21.54 | U7.18 86.08,13.82 | 86.08,13.82 87.38,13.82 | U7.17 85.43,13.82 | 85.43,13.82 86.08,13.82 | U7.16 84.78,13.82 85.43,13.82 | 71.53,21.54 71.12,21.13 | 53.65,21.54 53.24,21.13 | C15.2 51.78,38.81 52.02,38.81
  Top 0.533: C19.2 93.34,16.88 93.34,19.68 93.98,20.32 94.61,20.32 95.25,19.68 U3.2
  Top 0.61: J4.1 94.35,12.06 C19.2 | 93.34,20.73 93.34,23.76 C20.2 C5.2 93.03,29.26 93.03,33.02 94.3,34.29 C6.2 | 93.34,20.73 93.34,19.68 | 45.11,23.57 43.48,23.57 42.67,22.76 42.67,22.11 C2.2 34.99,21.98 34.14,21.13 27.23,21.13 26.24,22.12 C1.2 24.79,22.15 24.79,22.76 25.6,23.57 26.82,23.57 | 62.99,23.57 61.37,23.57 60.55,22.76 60.55,22.21 C3.2 54.09,21.98 53.65,21.54 | 80.87,23.57 79.65,23.57 78.84,22.76 78.84,22.08 C4.2 78.74,21.95 71.93,21.95 71.53,21.54 | 89.81,20.73 93.34,20.73 | 52.02,38.81 v52.83,38.81 54.86,38.81 v56.69,40.64 | v42.67,38.81 43.28,39.62 43.28,40.05 C9.2 | v33.53,44.91 33.54,44.92 C16.2 33.54,46.52 32.31,47.75 v32.31,50.6 32.31,50.8 32.51,51 34.95,51 35.36,50.6 35.36,48.88 C10.2 | C17.2 32.41,57.2 v32.31,57.1 | v59.54,45.52 59.13,45.52 58.52,46.13 58.52,46.74 | v57.91,61.16 58.52,61.77 59.74,61.77 | 59.74,61.77 60.35,61.16 60.35,58.79 | C13.2 60.35,58.79 | 60.35,58.79 60.35,58.73 | v53.85,64.21 53.65,64.41 53.65,66.24 53.03,66.85 49.99,66.85 50.09,66.75 C18.2 | v44.27,64.21 43.28,64.21 | 59.74,61.77 59.74,64.01 v62.79,67.06 | v80.67,67.06 86.31,67.06 | 86.31,67.06 CON1.1 | R3.2 71.49,67.09 v71.53,67.06 | 86.31,67.06 86.31,65.02 CON1.3 | v7.92,35.36 6.47,33.93 D1.C
  Bottom 0.305: v13.61,55.68 13.41,55.47 | v14.43,46.33 13.41,46.33
  Bottom 0.406: v51.41,26.21 52.83,27.64 v52.83,38.81
  Bottom 0.61: ST1.26 95.39,8.74 94.16,9.98 J4.1 | v52.83,38.81 v42.67,38.81 38,38.81 | v33.53,44.91 33.53,43.28 38,38.81 | v32.31,57.1 v32.31,50.6 | v56.69,40.64 v59.54,43.69 v59.54,45.52 59.54,54.25 | 59.54,54.25 59.33,54.46 v53.44,54.46 | 59.54,54.25 59.54,58.52 58.52,59.54 58.12,59.54 57.91,59.74 v57.91,61.16 54.86,64.21 v53.85,64.21 v44.27,64.21 | 38,38.81 17.07,38.81 | 17.07,38.81 13.41,42.47 13.41,46.33 13.41,55.47 | J1.4 67.87,73.61 67.87,72.14 v62.79,67.06 v71.53,67.06 v80.67,67.06 | v7.92,35.36 11.38,38.81 17.07,38.81
  other vias: 80.06,10.97 74.78,20.32 91.44,19.3 75.18,32.11
  pour Top (isolate 0.305): 1.02,8.94 1.02,76.81 98.96,76.81 98.96,8.94
  pour Bottom (isolate 0.305): 1.22,8.94 1.22,76.61 98.76,76.61 98.76,8.94
MEMCS
  Top 0.305: U1.27 40.35,57.82 40.44,57.91 40.44,58.52 38.41,60.55 29.57,60.55 J2.1 25.3,56.29 19.51,56.29 19.33,56.11 U2.1
MISO  (via drill 0.38)
  Top 0.305: v18.09,53.85 18.09,55.63 U2.2 | U1.32 40.59,55.32 v40.64,55.27
  Bottom 0.305: v18.09,53.85 18.69,53.24 20.12,53.24 22.1,51.26 J2.3 26.87,51.26 31.5,55.88 31.5,57.91 34.54,60.96 35.56,60.96 36.17,60.35 36.17,55.88 36.78,55.27 v40.64,55.27
MOSI  (via drill 0.38)
  Top 0.305: U1.49 40.35,46.82 40.44,46.74 40.44,46.13 37.19,42.88 v32.21,42.88 | v16.28,52.05 15.52,51.28 U2.5
  Bottom 0.305: v16.28,52.05 16.46,52.22 19.91,52.22 22.96,49.17 24.89,49.17 J2.4 31.19,42.88 v32.21,42.88
N$1  (via drill 0.38)
  Top 0.406: v91.9,10.16 92.86,10.16 ST1.24
  Bottom 0.406: ST1.24 arc-90 92.71,4.75 92.66,9.75 92.25,10.16 v91.9,10.16
N$2  (via drill 0.38)
  Top 0.406: v90.17,10.16 90.31,9.75 ST1.23
  Bottom 0.406: ST1.23 90.17,4.61 v90.17,10.16
N$5
  Top 0.61: R1.2 D1.A
PH0
  Top 0.305: U1.84 64.95,50.32 78.64,64.01 78.64,69.09 82.09,72.54 94.28,72.54 94.89,71.93 94.89,67.67 94.49,67.26 88.95,67.26 CON1.2
PH1
  Top 0.305: U1.85 64.44,50.82 77.83,64.21 77.83,69.29 81.89,73.36 95.3,73.36 95.71,72.95 95.71,65.43 95.1,64.82 88.95,64.82 CON1.4
PH2
  Top 0.305: U1.86 63.92,51.32 77.01,64.41 77.01,69.49 81.69,74.17 95.91,74.17 96.52,73.56 96.52,62.79 95.91,62.18 88.95,62.18 CON1.6
PH3
  Top 0.305: U1.87 63.41,51.82 76.2,64.62 76.2,69.7 81.48,74.98 96.72,74.98 97.33,74.37 97.33,60.35 96.72,59.74 88.95,59.74 CON1.8
Q3  (via drill 0.38)
  Top 0.305: v67.87,9.35 68.31,9.79 R2.2
  Bottom 0.203: ST1.37 67.87,5.02
  Bottom 0.305: 67.87,5.02 v67.87,9.35
Q3R
  Top 0.203: R2.1 66.62,10.57
  Top 0.305: 66.62,10.57 U6.16
Q3R_33
  Top 0.305: U6.4 67.27,28.85 67.26,28.85 61.57,34.54 52.02,34.54 51.21,35.36 51.21,36.58 50.54,37.24 U1.70
RDDATA  (via drill 0.38)
  Top 0.203: 88.34,32.26 R5.2
  Top 0.305: v90.22,34.14 88.34,32.26 | R5.2 88.59,31.6 v88.59,23.98 | v84.12,19.1 84.12,18.29 83.48,17.64 U7.14
  Bottom 0.305: CON1.16 92.71,49.53 94.69,47.55 94.69,38.61 v90.22,34.14 | v88.59,23.98 84.12,19.51 v84.12,19.1
RDDATA_33
  Top 0.305: U1.96 53.28,56.32 52.43,55.47 52.43,47.35 55.07,44.7 57.3,44.7 62.59,39.42 73.36,39.42 84.12,28.65 U7.6
RW  (via drill 0.38)
  Top 0.203: ST1.18 77.62,4.61 | U6.18 67.87,16.04 67.87,17.48 v67.06,18.29 | v34.14,22.76 33.26,23.64 U4.1
  Top 0.305: 77.62,4.61 77.62,9.35 73.97,13.01 68.68,13.01 67.92,13.77 U6.18
  Bottom 0.203: v67.06,18.29 53.65,18.29 50.39,21.54 35.36,21.54 v34.14,22.76
RW_33
  Top 0.305: U6.2 68.57,30.19 60.76,38 51.61,38 51.04,38.57 U1.71
SCLK
  Top 0.305: U2.6 16.87,49.58 16.87,50.8 19.91,53.85 25.3,53.85 J2.2 30.07,58.52 34.34,58.52 34.44,58.32 34.44,56.08 34.8,55.82 U1.31
  Bottom 0.305: 25.4,53.85 J2.2
SEL  (via drill 0.38)
  Top 0.305: U1.78 57.12,47.32 57.51,46.94 57.51,45.92 58.73,44.7 78.23,44.7 83.31,39.62 93.07,39.62 v93.67,40.23 | v93.67,44.5 93.67,53.44 92.66,54.46 89.05,54.46 CON1.12
  Bottom 0.305: v93.67,40.23 v93.67,44.5
SENSE  (via drill 0.38)
  Top 0.203: 87.93,35.91 R4.2 88.19,35.36
  Top 0.305: v89,36.98 87.93,35.91 | 88.19,35.36 90.63,35.36 91.44,34.54 91.44,34.14 89.41,32.11 v89.41,22.76 | v82.91,18.29 82.83,18.21 U7.13
  Bottom 0.203: CON1.20 89,44.35
  Bottom 0.305: 89,44.35 v89,36.98 | v89.41,22.76 84.94,18.29 v82.91,18.29
SENSE_33
  Top 0.305: U1.97 52.76,56.82 51.82,55.88 51.82,47.14 54.86,44.09 57.1,44.09 62.59,38.61 73.15,38.61 83.48,28.28 U7.7
TCK
  Top 0.305: U1.91 62.36,53.82 72.95,64.41 72.95,66.04 | 72.95,66.04 72.95,73.61 J1.2 | R3.1 73.04,66.04 72.95,66.04
TDI
  Top 0.305: U1.94 56.95,55.32 57.1,55.47 57.1,55.88 57.91,56.69 63.8,56.69 70.05,62.94 70.05,73.25 J1.3
TDO
  Top 0.305: U1.95 56.23,55.82 arc90 56.29,55.88 57.71,57.3 62.79,57.3 65.43,59.94 65.43,73.61 J1.5
TMS
  Top 0.305: U1.90 62.87,53.32 74.57,65.02 74.57,72.69 J1.1 75.59,73.61
VCC  (via drill 0.38)
  Top 0.305: C7.1 19.33,46.59 19.33,47.75 | 19.33,47.75 U2.8 | U2.7 18.09,49.48 18.09,48.16 | 18.09,48.16 18.49,47.75 19.33,47.75 | U2.3 16.87,55.73 16.87,57.51 16.26,58.12 14.02,58.12 12.6,56.69 12.6,48.97 14.02,47.55 17.48,47.55 18.09,48.16
  Top 0.406: 51.21,17.48 51.19,17.45 U5.20 51.34,15.99 51.61,16.26 | 69.49,16.26 U6.20 69.22,17.75 69.09,17.88 | 87.78,16.26 87.51,15.99 U7.20 87.38,17.47 87.38,17.48 | 33.73,17.48 33.2,16.94 U4.20 33.2,14.76 34.23,13.73 R6.1
  Top 0.533: U3.5 94.3,22.55 94.61,22.86 95.25,22.86 96.15,23.76 C20.1
  Top 0.61: L1.2 94.35,30.11 94.93,29.53 95.57,29.53 96.2,28.89 96.2,27.99 C5.1 96.15,26.42 v96.72,26.42 96.11,26.42 | C2.1 43.22,19.51 49.99,19.51 51.21,18.29 51.21,17.48 | 69.49,16.26 v70.31,16.26 | 96.11,26.42 96.11,24.79 96.14,24.77 C20.1 | v52.43,16.26 51.61,16.26 | v88.59,16.26 87.78,16.26 | 33.73,18.29 32.11,19.91 25.17,19.91 C1.1 23.16,20.32 19.59,23.89 C7.1 | C3.1 61,19.51 68.28,19.51 69.09,18.69 69.09,17.88 | C4.1 79.42,20.32 85.75,20.32 87.38,18.69 87.38,17.48 | 33.73,18.29 33.73,17.48 | v49.17,18.29 41.86,18.29 40.64,19.51 34.95,19.51 33.73,18.29 | v96.72,23.16 96.15,23.74 96.15,23.76 | 96.11,28.04 96.11,26.42
  Bottom 0.61: v96.72,26.42 v96.72,23.16 96.72,20.73 92.25,16.26 v88.59,16.26 v70.31,16.26 v52.43,16.26 50.39,18.29 v49.17,18.29
VCC_F  (via drill 0.38)
  Top 0.305: U1.23 42.04,62.63 41.47,63.2 C11.1 | U1.5 51.04,62.42 51.21,62.59 51.61,62.59 52.21,63.18 C12.1 | U1.11 48.04,66.72 48.16,66.84 48.16,66.85 48.2,66.85 C18.1 | U1.26 35.68,58.32 35.34,57.98 C17.1 | C10.1 33.73,48.78 33.73,47.95 34.14,47.55 36.65,47.55 37.43,48.32 U1.46 | C16.1 arc90 35.65,45.92 38.2,45.92 38.61,46.33 U1.50 | U1.55 43.04,42.63 41.86,41.45 41.45,41.03 C9.1 | C15.1 53.65,40.55 53.65,41.05 52.04,42.65 U1.73 | U1.93 57.71,54.82 57.71,55.68 58.12,56.08 59.94,56.08 60.39,55.64 C8.1 60.45,54.76 60.55,54.66 | U1.100 57.71,58.32 57.91,58.52 58.28,58.52 C13.1 58.59,58.86 58.52,58.93 | 60.55,46.94 60.44,46.94 C14.1 60.35,46.92 60.35,47.95 59.98,48.32 U1.80
  Top 0.508: v48.16,68.28 48.16,66.85
  Top 0.61: L1.1 C6.1 96.15,35.93 95.91,36.17 93.47,36.17 92.66,35.36 92.66,34.14 91.03,32.51 91.03,31.29 | 91.03,31.29 v91.03,30.07 | v91.03,28.85 91.85,29.67 91.85,30.48 91.03,31.29 | v54.86,40.23 53.58,40.23 C15.1 | v40.23,40.23 41.47,40.23 C9.1 | v35.36,59.33 35.36,57.22 C17.1 | v35.36,43.89 35.36,46.33 35.34,46.31 C16.1 | v33.53,50.09 33.53,48.85 | C10.1 33.53,48.85 | 33.53,48.85 33.53,48.77 | v61.77,54.66 60.55,54.66 | v61.77,46.94 60.55,46.94 | v58.93,60.55 58.52,60.15 58.52,58.93 58.52,58.73 | v41.15,65.84 41.15,64.53 C11.1 | v52.22,65.43 52.22,64.12 C12.1
  Bottom 0.61: v91.03,30.07 89.41,30.07 | v91.03,28.85 90.63,28.85 89.41,30.07 | 89.41,30.07 65.84,30.07 61.57,34.34 | 61.57,34.34 55.68,40.23 v54.86,40.23 v40.23,40.23 39.01,40.23 v35.36,43.89 35.36,50.09 | 35.36,50.09 v35.36,59.33 | v33.53,50.09 35.36,50.09 | 60.76,60.55 60.96,60.55 61.77,59.74 v61.77,54.66 v61.77,46.94 61.77,34.54 61.57,34.34 | 60.76,60.55 v58.93,60.55 | 55.88,65.43 v52.22,65.43 49.38,68.28 v48.16,68.28 45.72,65.84 v41.15,65.84 | 55.88,65.43 60.76,60.55 | 55.88,65.43 55.88,66.7 J1.6
WRDATA  (via drill 0.38)
  Top 0.305: U1.83 75.14,49.82 83.72,41.25 v91.24,41.25
  Bottom 0.305: v91.24,41.25 91.24,45.92 90.22,46.94 88.95,46.94 CON1.18

### Text on the board
tPlace: J1 | FPGA DISK CONTROLLER / ORIGINAL DESIGN BY BIG MESS O' WIRES | 3V3 | TDO | GND | TDI | TCK | TMS | v1.0 | C18 | R3 | C11 | C12 | C13 | CS | C17 | C8 | SCLK | U2 | MISO | U1 | MOSI | C10 | C7 | J2 | C16 | C14 | CON1 | J3 | C9 | C15 | R1 | R4 | C6 | D1 | R5 | L1 | C5 | C20 | C1 | C2 | C3 | C4 | U4 | U5 | U6 | U7 | U3 | C19 | R6 | J4 | R2 | 1 | 25